# Altium project Dehumidity.PrjPcb
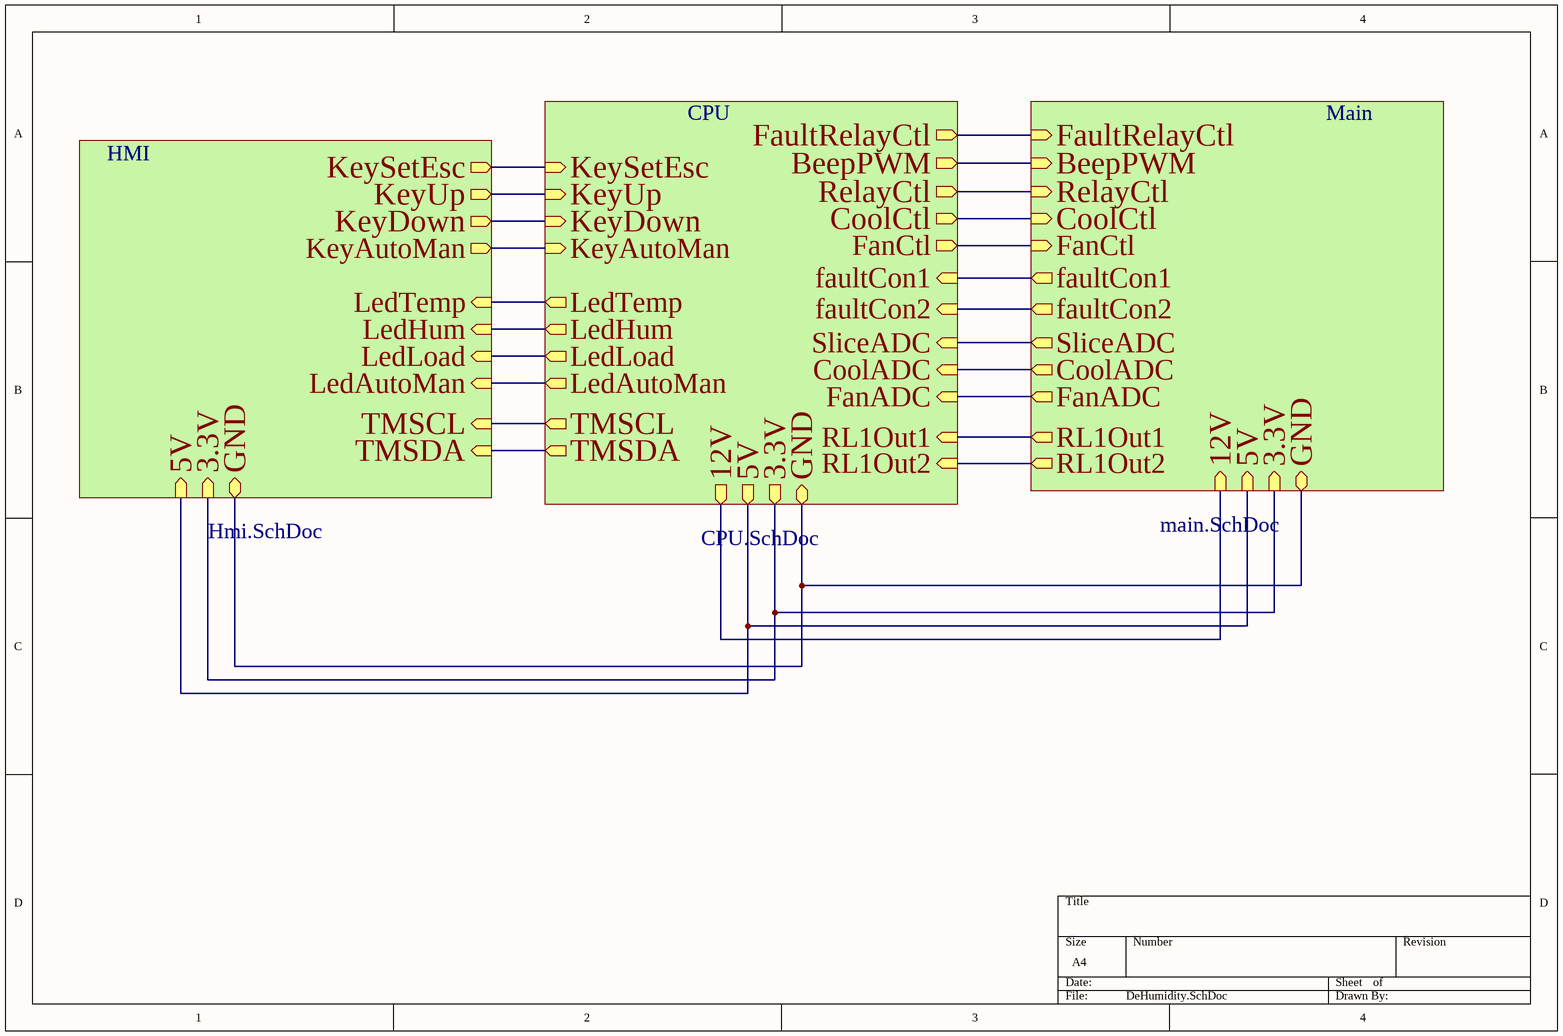
[diagram p0: DeHumidity.SchDoc]
4 sheets, 128 parts. Net scope: hierarchical (ports join the sheet entries above them; power ports are global).
Board file: PCB1_v01.PcbDoc
Sheets:
  DeHumidity.SchDoc
    HMI = Hmi.SchDoc
    Main = main.SchDoc
    CPU = CPU.SchDoc

## Sheet DeHumidity.SchDoc
size A4

### Sub-sheets
CPU = CPU.SchDoc: LedTemp (out), 3.3V (out), GND (bidir), 5V (out), LedHum (out), LedLoad (out), LedAutoMan (out), KeyAutoMan (in), KeyUp (in), KeyDown (in), KeySetEsc (in), RL1Out1 (in), RelayCtl (out), CoolCtl (out), BeepPWM (out), FanCtl (out), SliceADC (in), CoolADC (in), FanADC (in), 12V (out), TMSCL (out), TMSDA (out), RL1Out2 (in), faultCon1 (in), faultCon2 (in), FaultRelayCtl (out)
HMI = Hmi.SchDoc: LedTemp (in), KeyAutoMan (out), KeyUp (out), KeyDown (out), KeySetEsc (out), LedHum (in), LedLoad (in), LedAutoMan (in), TMSCL (in), TMSDA (in), 3.3V (in), GND (bidir), 5V (in)
Main = main.SchDoc: RL1Out1 (out), RelayCtl (in), CoolCtl (in), BeepPWM (in), SliceADC (out), CoolADC (out), FanADC (out), FanCtl (in), 3.3V (in), GND (bidir), 5V (in), 12V (in), RL1Out2 (out), faultCon1 (out), faultCon2 (out), FaultRelayCtl (in)

### Nets
3.3V: sheet HMI/3.3V, sheet Main/3.3V, sheet CPU/3.3V
5V: sheet HMI/5V, sheet Main/5V, sheet CPU/5V
12V: sheet Main/12V, sheet CPU/12V
GND: sheet HMI/GND, sheet Main/GND, sheet CPU/GND
NetC1_2: sheet HMI/KeySetEsc, sheet CPU/KeySetEsc
NetC2_2: sheet HMI/KeyUp, sheet CPU/KeyUp
NetC3_2: sheet HMI/KeyDown, sheet CPU/KeyDown
NetC4_2: sheet HMI/KeyAutoMan, sheet CPU/KeyAutoMan
NetC10_2: sheet Main/FanADC, sheet CPU/FanADC
NetC11_2: sheet Main/CoolADC, sheet CPU/CoolADC
NetC15_2: sheet Main/SliceADC, sheet CPU/SliceADC
NetD1_2: sheet HMI/LedTemp, sheet CPU/LedTemp
NetD2_2: sheet HMI/LedHum, sheet CPU/LedHum
NetD3_2: sheet HMI/LedLoad, sheet CPU/LedLoad
NetD4_2: sheet HMI/LedAutoMan, sheet CPU/LedAutoMan
NetP9_7: sheet Main/faultCon1, sheet CPU/faultCon1
NetP9_8: sheet Main/faultCon2, sheet CPU/faultCon2
NetP9_9: sheet Main/RL1Out2, sheet CPU/RL1Out2
NetP9_10: sheet Main/RL1Out1, sheet CPU/RL1Out1
NetR15_1: sheet HMI/TMSDA, sheet CPU/TMSDA
NetR16_1: sheet HMI/TMSCL, sheet CPU/TMSCL
NetR21_2: sheet Main/CoolCtl, sheet CPU/CoolCtl
NetR22_2: sheet Main/FanCtl, sheet CPU/FanCtl
NetR34_2: sheet Main/BeepPWM, sheet CPU/BeepPWM
NetR35_2: sheet Main/RelayCtl, sheet CPU/RelayCtl
NetR54_2: sheet Main/FaultRelayCtl, sheet CPU/FaultRelayCtl

## Sheet Hmi.SchDoc
size A4
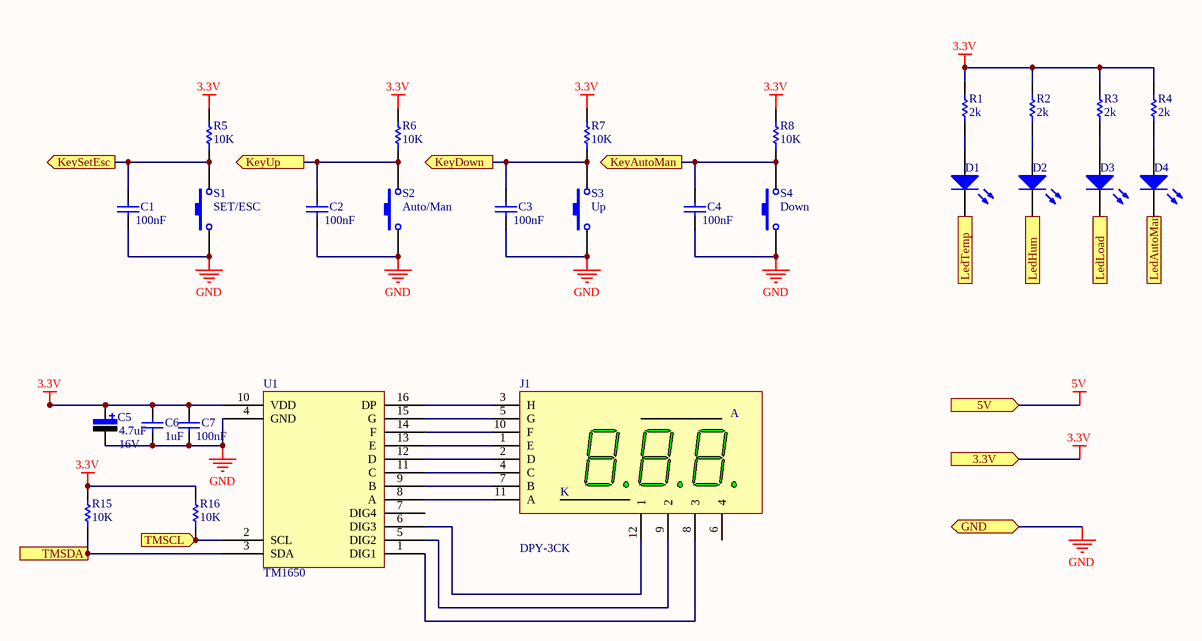
[diagram p1: Hmi.SchDoc]

### Parts
C1  100nF (104) 10% 50V  [0603_C]  (value not drawn)
C2  100nF (104) 10% 50V  [0603_C]  (value not drawn)
C3  100nF (104) 10% 50V  [0603_C]  (value not drawn)
C4  100nF (104) 10% 50V  [0603_C]  (value not drawn)
C5  value 4.7uF  Vol: 16V  [CAP-1206]  (hidden comment: 4.7uF/16V)
C6  1uF (105) 10% 50V  [0603_C]  (value not drawn)
C7  100nF (104) 10% 50V  [0603_C]  (value not drawn)
D1  LED  [LED(小)]  (value not drawn)
D2  LED  [LED(小)]  (value not drawn)
D3  LED  [LED(小)]  (value not drawn)
D4  LED  [LED(小)]  (value not drawn)
J1  DPY-3CK  [DYP-3BIT_2.8]
R1  2k  [0603_R]
R2  2k  [0603_R]
R3  2k  [0603_R]
R4  2k  [0603_R]
R5  10K  [0603_R]
R6  10K  [0603_R]
R7  10K  [0603_R]
R8  10K  [0603_R]
R15  10K  [0603_R]
R16  10K  [0603_R]
S1  SET/ESC  [Switch_4_6*6]
S2  Auto/Man  [Switch_4_6*6]
S3  Up  [Switch_4_6*6]
S4  Down  [Switch_4_6*6]
U1  TM1650  [SOIC-16_150mil]

### Ports
3.3V (in), 5V (in), GND (bidir), KeyAutoMan (out), KeyDown (out), KeySetEsc (out), KeyUp (out), LedAutoMan (in), LedHum (in), LedLoad (in), LedTemp (in), TMSCL (in), TMSDA (in)

### Nets
3.3V: C5.1 C6.2 C7.2 R1.1 R2.1 R3.1 R4.1 R5.2 R6.2 R7.2 R8.2 R15.2 R16.2 U1.10(VDD) ; port 3.3V
GND: C1.1 C2.1 C3.1 C4.1 C5.2 C6.1 C7.1 S1.1 S2.1 S3.1 S4.1 U1.4(GND) ; port GND
NetC1_2: C1.2 R5.1 S1.2 ; port KeySetEsc
NetC2_2: C2.2 R6.1 S2.2 ; port KeyUp
NetC3_2: C3.2 R7.1 S3.2 ; port KeyDown
NetC4_2: C4.2 R8.1 S4.2 ; port KeyAutoMan
NetD1_1: D1.1(A) R1.2
NetD1_2: D1.2(K) ; port LedTemp
NetD2_1: D2.1(A) R2.2
NetD2_2: D2.2(K) ; port LedHum
NetD3_1: D3.1(A) R3.2
NetD3_2: D3.2(K) ; port LedLoad
NetD4_1: D4.1(A) R4.2
NetD4_2: D4.2(K) ; port LedAutoMan
NetJ1_1: J1.1(E) U1.13(E)
NetJ1_2: J1.2(D) U1.12(D)
NetJ1_3: J1.3(H) U1.16(DP)
NetJ1_4: J1.4(C) U1.11(C)
NetJ1_5: J1.5(G) U1.15(G)
NetJ1_7: J1.7(B) U1.9(B)
NetJ1_8: J1.8(3) U1.1(DIG1)
NetJ1_9: J1.9(2) U1.5(DIG2)
NetJ1_10: J1.10(F) U1.14(F)
NetJ1_11: J1.11(A) U1.8(A)
NetJ1_12: J1.12(1) U1.6(DIG3)
NetR15_1: R15.1 U1.3(SDA) ; port TMSDA
NetR16_1: R16.1 U1.2(SCL) ; port TMSCL

Not connected (* = marked no-connect by the designer): J1 6(4); U1 7(DIG4)

### Notes on the sheet
- (in symbol 0603 1uF (105) 10% 50V) 1uF
- (in symbol 0603 100nF (104) 10% 50V) 100nF
- (in symbol DPY-3CK_1) K

### Library data of the parts
C1-C4 C7 = 0603 100nF (104) 10% 50V: 贴片电容; ComponentLink1Description: 供应商链接; ComponentLink1URL: http://www.szlcsc.com/product/details_15331.html; Package: 0603; Supplier: LC; SuppliersPartNumber: C14663
C5 = Cap Pol: 4.7uF/16V钽电容; Published: 8-Jun-2000; LatestRevisionDate: 17-Jul-2002; LatestRevisionNote: Re-released for DXP Platform.; PackageReference: RB7.6-15; Publisher: Altium Limited
C6 = 0603 1uF (105) 10% 50V: 贴片电容; ComponentLink1Description: 供应商链接; ComponentLink1URL: http://www.szlcsc.com/product/details_16531.html; Package: 0603; Supplier: LC; SuppliersPartNumber: C15849
D1-D4 = LED0: Typical INFRARED GaAs LED; Published: 8-Jun-2000; LatestRevisionDate: 08-Jul-2005; LatestRevisionNote: Mech Layer 1 removed.; PackageReference: LED-0; Publisher: Altium Limited
J1 = DPY-3CK_1: 共阴3位数码管
R1-R4 = RES1: 2k/±10%; 零件名称: 贴片电阻
R5-R8 R15 R16 = RES1: 10K/±10%; 零件名称: 贴片电阻
S1-S4 = SW-PB: 6*6*5四脚直插轻触开关; 零件名称: 直插开关

## Sheet main.SchDoc
size A4
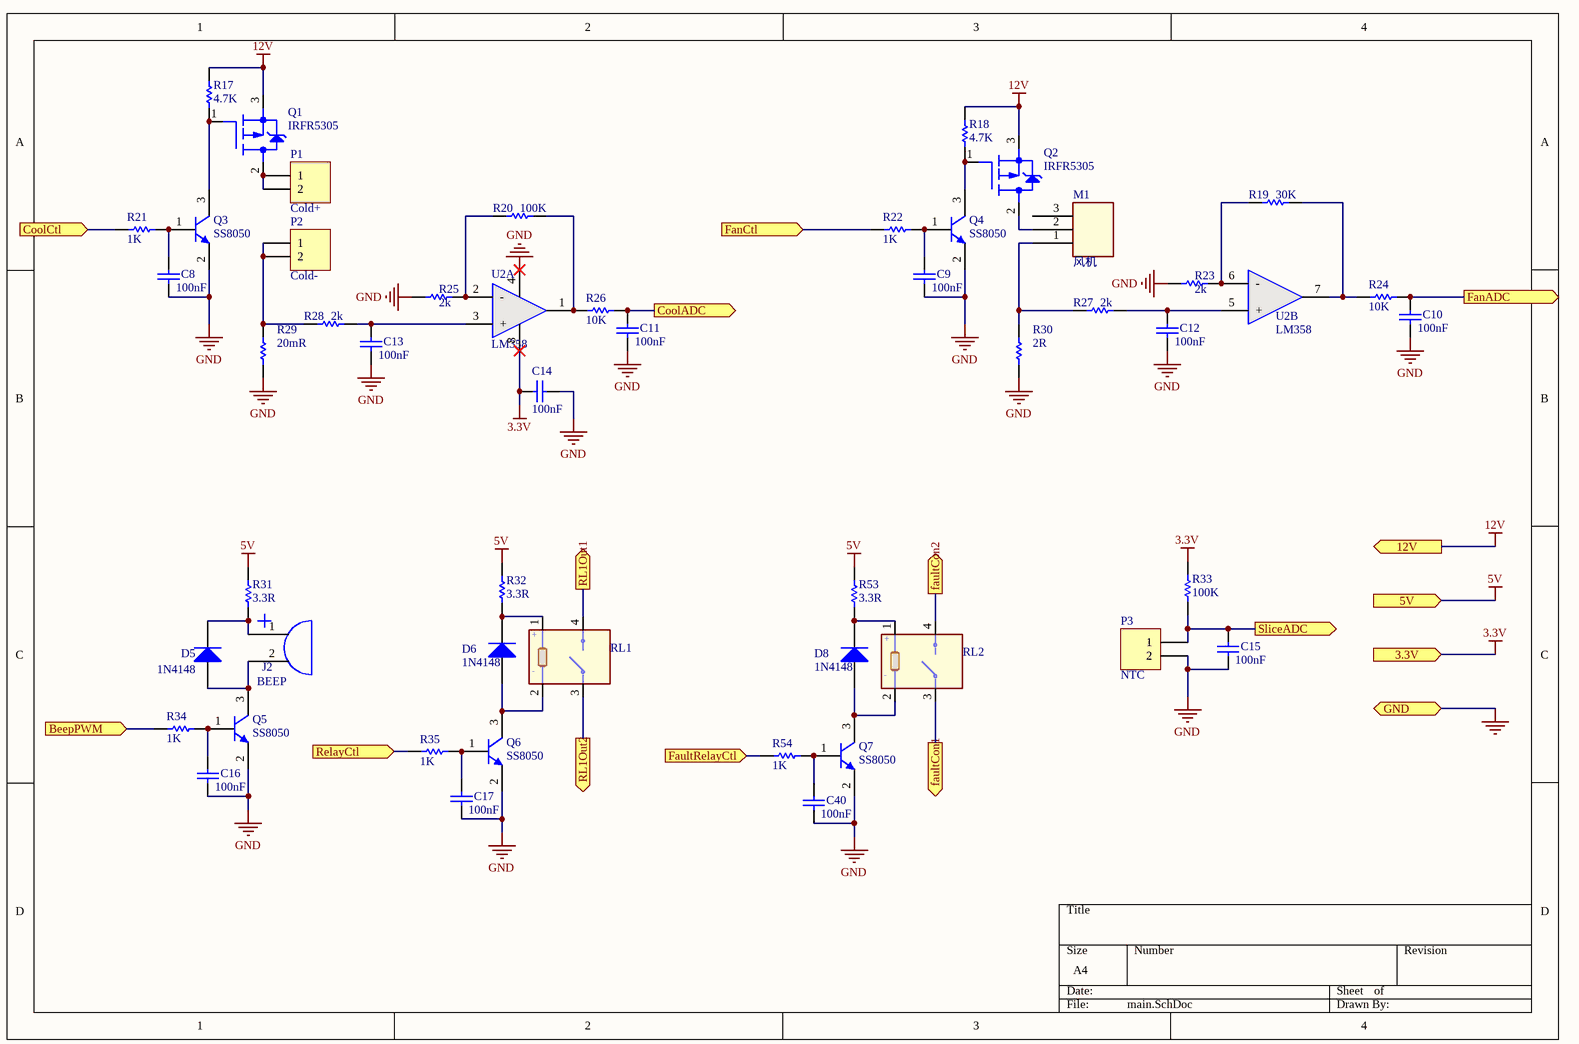
[diagram p2: main.SchDoc]

### Parts
C8  100nF (104) 10% 50V  [0603_C]  (value not drawn)
C9  100nF (104) 10% 50V  [0603_C]  (value not drawn)
C10  100nF (104) 10% 50V  [0603_C]  (value not drawn)
C11  100nF (104) 10% 50V  [0603_C]  (value not drawn)
C12  100nF (104) 10% 50V  [0603_C]  (value not drawn)
C13  100nF (104) 10% 50V  [0603_C]  (value not drawn)
C14  100nF (104) 10% 50V  [0603_C]  (value not drawn)
C15  100nF (104) 10% 50V  [0603_C]  (value not drawn)
C16  100nF (104) 10% 50V  [0603_C]  (value not drawn)
C17  100nF (104) 10% 50V  [0603_C]  (value not drawn)
C40  100nF (104) 10% 50V  [0603_C]  (value not drawn)
D5  1N4148  [DIODE-1206]
D6  1N4148  [DIODE-1206]
D8  1N4148  [DIODE-1206]
J2  BEEP  [Beep0905]
M1  风机  [connector3x2.5]
P1  Cold+  [ConSlice0.5]
P2  Cold-  [ConSlice0.5]
P3  NTC  [HDR1X2_2]
Q1  IRFR5305  [DPAK]
Q2  IRFR5305  [DPAK]
Q3  SS8050  [SOT-23]
Q4  SS8050  [SOT-23]
Q5  SS8050  [SOT-23]
Q6  SS8050  [SOT-23]
Q7  SS8050  [SOT-23]
R17  4.7K  [RESC1608N-R0603]
R18  4.7K  [RESC1608N-R0603]
R19  30K  [RESC1608N-R0603]
R20  100K  [RESC1608N-R0603]
R21  1K  [RESC1608N-R0603]
R22  1K  [RESC1608N-R0603]
R23  2k  [RESC1608N-R0603]
R24  10K  [RESC1608N-R0603]
R25  2k  [RESC1608N-R0603]
R26  10K  [RESC1608N-R0603]
R27  2k  [RESC1608N-R0603]
R28  2k  [RESC1608N-R0603]
R29  20mR  [Rsense10mm]
R30  2R  [R0.4x14.5]
R31  3.3R  [RESC1608N-R0603]
R32  3.3R  [RESC1608N-R0603]
R33  100K  [RESC1608N-R0603]
R34  1K  [RESC1608N-R0603]
R35  1K  [RESC1608N-R0603]
R53  3.3R  [RESC1608N-R0603]
R54  1K  [RESC1608N-R0603]
RL1  TXS2-24V  [ALDP112]  (value not drawn)
RL2  TXS2-24V  [ALDP112]  (value not drawn)
U2  LM358  [NSO8_N]  (parts A,B of 2)

### Ports
3.3V (in), 5V (in), 12V (out), BeepPWM (in), CoolADC (out), CoolCtl (in), FanADC (out), FanCtl (in), faultCon1 (out), faultCon2 (out), FaultRelayCtl (in), GND (bidir), RelayCtl (in), RL1Out1 (out), RL1Out2 (out), SliceADC (out)

### Nets
3.3V: C14.2 R33.1 U2.8(V+) ; port 3.3V
5V: R31.1 R32.1 R53.1 ; port 5V
12V: Q1.3(S) Q2.3(S) R17.1 R18.1 ; port 12V
GND: C8.1 C9.1 C10.1 C11.1 C12.1 C13.1 C14.1 C15.1 C16.1 C17.1 C40.1 P3.2 Q3.2(E) Q4.2(E) Q5.2(E) Q6.2(E) Q7.2(E) R23.2 R25.2 R29.1 R30.1 U2.4(V-) ; port GND
NetC8_2: C8.2 Q3.1(B) R21.1
NetC9_2: C9.2 Q4.1(B) R22.1
NetC10_2: C10.2 R24.1 ; port FanADC
NetC11_2: C11.2 R26.1 ; port CoolADC
NetC12_2: C12.2 R27.1 U2.5(+)
NetC13_2: C13.2 R28.1 U2.3(+)
NetC15_2: C15.2 P3.1 R33.2 ; port SliceADC
NetC16_2: C16.2 Q5.1(B) R34.1
NetC17_2: C17.2 Q6.1(B) R35.1
NetC40_2: C40.2 Q7.1(B) R54.1
NetD5_1: D5.1(A) J2.2 Q5.3(C)
NetD5_2: D5.2(K) J2.1 R31.2
NetD6_1: D6.1(A) Q6.3(C) RL1.2
NetD6_2: D6.2(K) R32.2 RL1.1
NetD8_1: D8.1(A) Q7.3(C) RL2.2
NetD8_2: D8.2(K) R53.2 RL2.1
NetM1_1: M1.1 R27.2 R30.2
NetM1_2: M1.2 Q2.2(D)
NetP1_1: P1.1 P1.2 Q1.2(D)
NetP2_1: P2.1 P2.2 R28.2 R29.2
NetP9_7: RL2.3 ; port faultCon1
NetP9_8: RL2.4 ; port faultCon2
NetP9_9: RL1.3 ; port RL1Out2
NetP9_10: RL1.4 ; port RL1Out1
NetQ1_1: Q1.1(G) Q3.3(C) R17.2
NetQ2_1: Q2.1(G) Q4.3(C) R18.2
NetR19_1: R19.1 R24.2 U2.7(OUT2)
NetR19_2: R19.2 R23.1 U2.6(-)
NetR20_1: R20.1 R26.2 U2.1(OUT1)
NetR20_2: R20.2 R25.1 U2.2(-)
NetR21_2: R21.2 ; port CoolCtl
NetR22_2: R22.2 ; port FanCtl
NetR34_2: R34.2 ; port BeepPWM
NetR35_2: R35.2 ; port RelayCtl
NetR54_2: R54.2 ; port FaultRelayCtl

Not connected (* = marked no-connect by the designer): M1 3

### Notes on the sheet
- (in symbol 0603 100nF (104) 10% 50V) 100nF
- (in symbol SACE_TXS2-24V_1) +

### Library data of the parts
C8-C17 C40 = 0603 100nF (104) 10% 50V: 贴片电容; ComponentLink1Description: 供应商链接; ComponentLink1URL: http://www.szlcsc.com/product/details_15331.html; Package: 0603; Supplier: LC; SuppliersPartNumber: C14663
D5 = Diode: 二极管; Published: 8-Jun-2000; LatestRevisionDate: 17-Jul-2002; LatestRevisionNote: Re-released for DXP Platform.; PackageDocument: Sep-1996; PackageReference: SMC; Publisher: Altium Limited; Code_JEDEC: DO-214-AB; Type: 1N4148
D6 D8 = Diode: 二极管; Type: M7; Published: 8-Jun-2000; LatestRevisionDate: 17-Jul-2002; LatestRevisionNote: Re-released for DXP Platform.; PackageDocument: Sep-1996; PackageReference: SMC; Publisher: Altium Limited; Code_JEDEC: DO-214-AB
J2 = BEEP: 蜂鸣器
M1 = SACE_CON_3: MALE CONN. 3 POLES P=7.62mm; Mfr_name1: WEIDMULLER; Mfr_Part_Number1: 1625260000; Part_type: MALE\THT; RU_code: RU6199001; Nr_pole: 3; Nr_row: 1; Prepared: BONOMI P.; Approved: LANZONI L.; Valore: 1625260000; Case_Size: -; Width: 8.5; Height: 12; Plating: -; Max_Operating_temp: -; Min_Operating_temp: -; Solderability_temp: -; Max_storage_temp: -; Min_storage_temp: -; Datasheet: K:\ORCAD CAPTURE CIS DATABASE\DATASHEET\CONNECTORS; Make_date: L6622; Last_rev_date: L6622; RoHs: True; Export_Control: N.A.
P1-P3 = Header 2: Header, 2-Pin; LatestRevisionDate: 17-Jul-2002; LatestRevisionNote: Re-released for DXP Platform.; Publisher: Altium Limited
Q1 Q2 = SACE_MOSFET_P: P-CH MOSFET LOGIC LEVEL 12A 60V SMD; Mfr_name1: ST; Mfr_Part_Number1: STD12NF06L; Part_Type: MOSFET\N-CHANNEL\SMD; RU_code: RU5189002; PackageID: D-PAK_AA_PITCH2.286MM_2PINS; Solderability_temp: 10s at 275°C; Max_operating_temp: +175°C; Min_operating_temp: -55°C; Prepared: BONOMI P.; Approved: MANZOLI R.; Notes: ST: / STD12NE06L-T4 is obsolete; Tolerance: -; Case_size: DPAK; Max_storage_temp: +175°C; Min_storage_temp: -55°C; Datasheet: K:\ORCAD CAPTURE CIS DATABASE\DATASHEET\DISCRETE; Make_date: L2587_DT; Last_rev_date: L3084_DT; RoHs: True; Export Control: N.A.; Valore: IRFR5305
Q3-Q7 = SS8050: NPN贴片三极管; Published: 8-Jun-2000; LatestRevisionDate: 15-Jan-2003; LatestRevisionNote: PCB Footprint 'BCY-W3/D4.7' replaced; DatasheetDocument: 1997; PackageDocument: Sep-1998; PackageReference: TO-92A; Publisher: Altium Limited; Code_JEDEC: TO-92A; ComponentLink1Description: Manufacturer Link; ComponentLink1URL: http://www.fairchildsemi.com/; ComponentLink2Description: Datasheet; ComponentLink2URL: http://www.fairchildsemi.com/ds/2N%2F2N3904.pdf
R17 R18 = RES1: 4.7K/±10%; 零件名称: 贴片电阻
R19 = RES1: 30K/±1%; 零件名称: 贴片电阻
R20 R33 = RES1: 100K/±10%; 零件名称: 贴片电阻
R21 R22 R34 R35 R54 = RES1: 1K/±10%; 零件名称: 贴片电阻
R23 R25 R27 R28 = RES1: 2k/±10%; 零件名称: 贴片电阻
R24 R26 = RES1: 10K/±10%; 零件名称: 贴片电阻
R29 R30 = Res1: Resistor; Value: 2mR; Published: 8-Jun-2000; LatestRevisionDate: 17-Jul-2002; LatestRevisionNote: Re-released for DXP Platform.; PackageReference: AXIAL-0.3; Publisher: Altium Limited; PackageDescription: Axial Device, Thru-Hole; 2 Leads; 0.3 in Pin Spacing
R31 R32 R53 = RES1: 3.3R/±10%; 零件名称: 贴片电阻
RL1 RL2 = SACE_TXS2-24V_1: MONOSTABLE RELAY 2POLES 110V 1A COIL24V; Mfr_name1: PANASONIC; Part_type: MONOSTABILE\THT; RU_code: RU6550001; Rated_voltage: 24; Max_operating_temp: +70°C; Min_operating_temp: -40°C; Life: 5x10^7 operations; Prepared: BONOMI P.; Approved: LANZONI L.; Valore: TXS2-24V; Mfr_Part_Number1: TXS2-24V; Case_Size: THT; Width: 7.4; Height: 8.2; Length: 15; Max_storage_temp: +70°C; Min_storage_temp: -40°C; Solderability_temp: -; Datasheet: K:\ORCAD CAPTURE CIS DATABASE\DATASHEET\RELAIS; Make_date: L9352; Last_rev_date: L9352; RoHs: True; Export_Control: N.A.
U2 = LM358: 双运放

## Sheet CPU.SchDoc
size A4
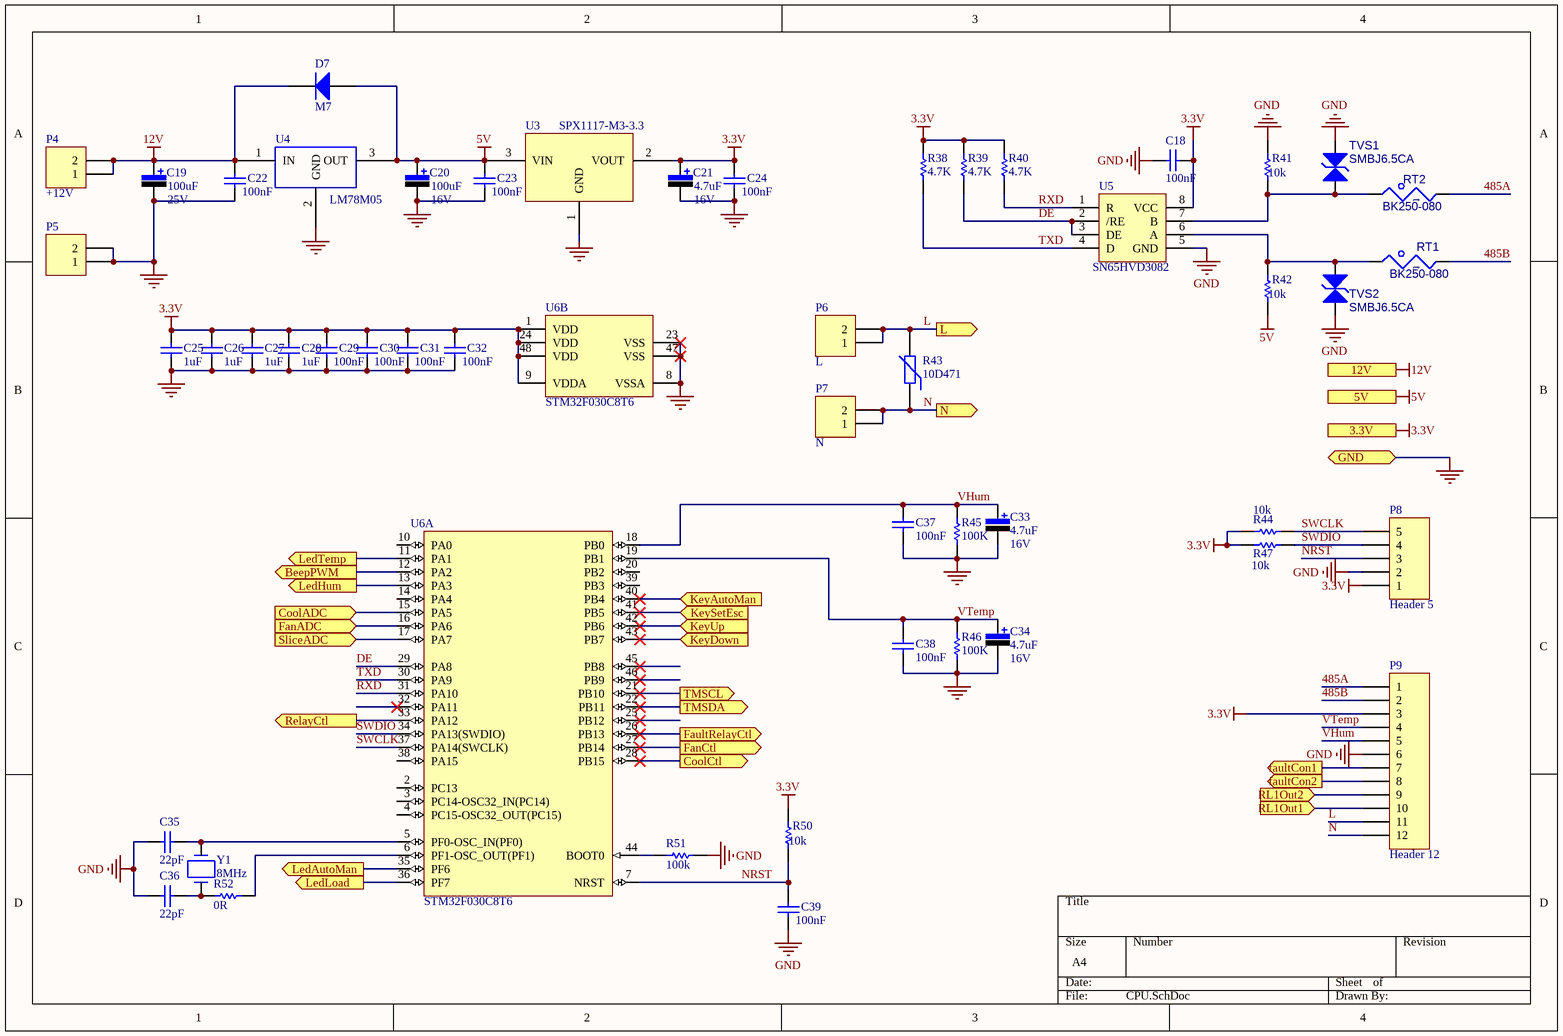
[diagram p3: CPU.SchDoc]

### Parts
C18  100nF (104) 10% 50V  [0603_C]  (value not drawn)
C19  value 100uF  Vol: 25V  [C-RB-8]  (hidden comment: 100uF/25V)
C20  value 100uF  Vol: 16V  [C-RB-8]  (hidden comment: 100uF/16V)
C21  value 4.7uF  Vol: 16V  [CAP-1206]  (hidden comment: 4.7uF/16V)
C22  100nF (104) 10% 50V  [0603_C]  (value not drawn)
C23  100nF (104) 10% 50V  [0603_C]  (value not drawn)
C24  100nF (104) 10% 50V  [0603_C]  (value not drawn)
C25  1uF (105) 10% 50V  [0603_C]  (value not drawn)
C26  1uF (105) 10% 50V  [0603_C]  (value not drawn)
C27  1uF (105) 10% 50V  [0603_C]  (value not drawn)
C28  1uF (105) 10% 50V  [0603_C]  (value not drawn)
C29  100nF (104) 10% 50V  [0603_C]  (value not drawn)
C30  100nF (104) 10% 50V  [0603_C]  (value not drawn)
C31  100nF (104) 10% 50V  [0603_C]  (value not drawn)
C32  100nF (104) 10% 50V  [0603_C]  (value not drawn)
C33  value 4.7uF  Vol: 16V  [CAP-1206]  (hidden comment: 4.7uF/16V)
C34  value 4.7uF  Vol: 16V  [CAP-1206]  (hidden comment: 4.7uF/16V)
C35  22pF (220) 5% 50V  [0603_C]  (value not drawn)
C36  22pF (220) 5% 50V  [0603_C]  (value not drawn)
C37  100nF (104) 10% 50V  [0603_C]  (value not drawn)
C38  100nF (104) 10% 50V  [0603_C]  (value not drawn)
C39  100nF (104) 10% 50V  [0603_C]  (value not drawn)
D7  M7  [DO214AC-SMA]
P4  +12V  [ConSlice0.5]
P5  (no value)  [ConSlice0.5]
P6  L  [ConSlice0.5]
P7  N  [ConSlice0.5]
P8  Header 5  [HDR1X5]
P9  Header 12  [HDR3.5-12P_1]
R38  4.7K  [RESC1608N-R0603]
R39  4.7K  [RESC1608N-R0603]
R40  4.7K  [RESC1608N-R0603]
R41  10k  [RESC1608N-R0603]
R42  10k  [RESC1608N-R0603]
R43  10D471  [10D471K]
R44  10k  [RESC1608N-R0603]
R45  100K  [RESC1608N-R0603]
R46  100K  [RESC1608N-R0603]
R47  10k  [RESC1608N-R0603]
R50  10k  [RESC1608N-R0603]
R51  100k  [RESC1608N-R0603]
R52  0R  [RESC1608N-R0603]
RT1  BK250-080  [RAD0.2]
RT2  BK250-080  [RAD0.2]
TVS1  SMBJ6.5CA  [1812]
TVS2  SMBJ6.5CA  [1812]
U3  SPX1117-M3-3.3  [SOT223]
U4  LM78M05  [DPAK]
U5  SN65HVD3082  [SO-8]
U6  STM32F030C8T6  [STM-LQFP48_N]  (parts A,B of 2)
Y1  8MHz  [HC49S_th]

### Ports
3.3V (out), 5V (out), 12V (out), BeepPWM (out), CoolADC (in), CoolCtl (out), FanADC (in), FanCtl (out), faultCon1 (out), faultCon2 (out), FaultRelayCtl (out), GND (bidir), KeyAutoMan (in), KeyDown (in), KeySetEsc (in), KeyUp (in), L (out), LedAutoMan (out), LedHum (out), LedLoad (out), LedTemp (out), N (out), RelayCtl (out), RL1Out1 (in), RL1Out2 (in), SliceADC (in), TMSCL (out), TMSDA (out)

### Nets
3.3V: C18.1 C21.1 C24.2 C25.2 C26.2 C27.2 C28.2 C29.2 C30.2 C31.2 C32.2 P8.1 P9.3 R38.1 R39.1 R40.1 R44.1 R47.1 R50.1 U3.2(VOUT) U5.8(VCC) U6.1(VDD) U6.9(VDDA) U6.24(VDD) U6.48(VDD) ; port 3.3V
5V: C20.1 C23.2 D7.1(A) R42.2 U3.3(VIN) U4.3(OUT) ; port 5V
12V: C19.1 C22.2 D7.2(K) P4.1 P4.2 U4.1(IN) ; port 12V
GND: C18.2 C19.2 C20.2 C21.2 C22.1 C23.1 C24.1 C25.1 C26.1 C27.1 C28.1 C29.1 C30.1 C31.1 C32.1 C33.2 C34.2 C35.2 C36.2 C37.1 C38.1 C39.1 P5.1 P5.2 P8.2 P9.6 R41.1 R45.2 R46.2 R51.2 TVS1.1(A) TVS2.2(K) U3.1(GND) U4.2(GND) U5.5(GND) U6.8(VSSA) U6.23(VSS) U6.47(VSS) ; port GND
485A: P9.1 RT2.1
485B: P9.2 RT1.1
DE: R39.2 U5.2(/RE) U5.3(DE) U6.29(PA8)
L: P6.1 P6.2 P9.11 R43.2 ; port L
N: P7.1 P7.2 P9.12 R43.1 ; port N
NRST: C39.2 P8.3 R50.2 U6.7(NRST)
RXD: R40.2 U5.1(R) U6.31(PA10)
SWCLK: P8.5 R44.2 U6.37(PA14(SWCLK))
SWDIO: P8.4 R47.2 U6.34(PA13(SWDIO))
TXD: R38.2 U5.4(D) U6.30(PA9)
VHum: C33.1 C37.2 P9.5 R45.1 U6.18(PB0)
VTemp: C34.1 C38.2 P9.4 R46.1 U6.19(PB1)
NetC1_2: U6.41(PB5) ; port KeySetEsc
NetC2_2: U6.42(PB6) ; port KeyUp
NetC3_2: U6.43(PB7) ; port KeyDown
NetC4_2: U6.40(PB4) ; port KeyAutoMan
NetC10_2: U6.16(PA6) ; port FanADC
NetC11_2: U6.15(PA5) ; port CoolADC
NetC15_2: U6.17(PA7) ; port SliceADC
NetC35_1: C35.1 U6.5(PF0-OSC_IN(PF0)) Y1.1
NetC36_1: C36.1 R52.2 Y1.2
NetD1_2: U6.11(PA1) ; port LedTemp
NetD2_2: U6.13(PA3) ; port LedHum
NetD3_2: U6.36(PF7) ; port LedLoad
NetD4_2: U6.35(PF6) ; port LedAutoMan
NetP9_7: P9.7 ; port faultCon1
NetP9_8: P9.8 ; port faultCon2
NetP9_9: P9.9 ; port RL1Out2
NetP9_10: P9.10 ; port RL1Out1
NetR15_1: U6.22(PB11) ; port TMSDA
NetR16_1: U6.21(PB10) ; port TMSCL
NetR21_2: U6.28(PB15) ; port CoolCtl
NetR22_2: U6.27(PB14) ; port FanCtl
NetR34_2: U6.12(PA2) ; port BeepPWM
NetR35_2: U6.33(PA12) ; port RelayCtl
NetR41_2: R41.2 RT2.2 TVS1.2(K) U5.7(B)
NetR42_1: R42.1 RT1.2 TVS2.1(A) U5.6(A)
NetR51_1: R51.1 U6.44(BOOT0)
NetR52_1: R52.1 U6.6(PF1-OSC_OUT(PF1))
NetR54_2: U6.26(PB13) ; port FaultRelayCtl

Not connected (* = marked no-connect by the designer): U6 2(PC13) 3(PC14-OSC32_IN(PC14)) 4(PC15-OSC32_OUT(PC15)) 10(PA0) 14(PA4) 20(PB2) 25(PB12)* 32(PA11)* 38(PA15) 39(PB3) 45(PB8)* 46(PB9)*

### Notes on the sheet
- (in symbol 0603 1uF (105) 10% 50V) 1uF
- (in symbol 0603 22pF (220) 5% 50V) 22pF
- (in symbol 0603 100nF (104) 10% 50V) 100nF
- (in symbol PTC-Thermistor) t

### Library data of the parts
C18 C22-C24 C29-C32 C37-C39 = 0603 100nF (104) 10% 50V: 贴片电容; ComponentLink1Description: 供应商链接; ComponentLink1URL: http://www.szlcsc.com/product/details_15331.html; Package: 0603; Supplier: LC; SuppliersPartNumber: C14663
C19 C20 = Cap Pol: Published: 8-Jun-2000; LatestRevisionDate: 17-Jul-2002; LatestRevisionNote: Re-released for DXP Platform.; PackageReference: RB7.6-15; Publisher: Altium Limited
C21 C33 C34 = Cap Pol: 4.7uF/16V钽电容; Published: 8-Jun-2000; LatestRevisionDate: 17-Jul-2002; LatestRevisionNote: Re-released for DXP Platform.; PackageReference: RB7.6-15; Publisher: Altium Limited
C25-C28 = 0603 1uF (105) 10% 50V: 贴片电容; ComponentLink1Description: 供应商链接; ComponentLink1URL: http://www.szlcsc.com/product/details_16531.html; Package: 0603; Supplier: LC; SuppliersPartNumber: C15849
C35 C36 = 0603 22pF (220) 5% 50V: 贴片电容; ComponentLink1Description: 供应商链接; ComponentLink1URL: http://www.szlcsc.com/product/details_2005.html; Package: 0603; Supplier: LC; SuppliersPartNumber: C1653
D7 = Diode: 二极管; Published: 8-Jun-2000; LatestRevisionDate: 17-Jul-2002; LatestRevisionNote: Re-released for DXP Platform.; PackageDocument: Sep-1996; PackageReference: SMC; Publisher: Altium Limited; Code_JEDEC: DO-214-AB; Type: M7
P4-P7 = Header 2: Header, 2-Pin; LatestRevisionDate: 17-Jul-2002; LatestRevisionNote: Re-released for DXP Platform.; Publisher: Altium Limited
P8 = Header 5: Header, 5-Pin; LatestRevisionDate: 17-Jul-2002; LatestRevisionNote: Re-released for DXP Platform.; Publisher: Altium Limited
P9 = Header 12: Header, 12-Pin; LatestRevisionDate: 17-Jul-2002; LatestRevisionNote: Re-released for DXP Platform.; Publisher: Altium Limited
R38-R40 = RES1: 4.7K/±10%; 零件名称: 贴片电阻
R41 R42 R44 R47 R50 = RES1: 10k/±10%; 零件名称: 贴片电阻
R43 = Res Varistor: Varistor (Voltage-Sensitive Resistor); Published: 24-Mar-1999; LatestRevisionDate: 29-May-2009; LatestRevisionNote: IPC-7351 Footprint Added.; PackageVersion: Mar-2003; PackageReference: 6-0805; Publisher: Altium Limited; PackageDescription: Chip Resistor 0805 Case Size; Code_IPC: RESC2012
R45 R46 R51 = RES1: 100K/±10%; 零件名称: 贴片电阻
R52 = RES1: 0R±10%; 零件名称: 贴片电阻
RT1 RT2 = PTC-Thermistor: 热敏电阻
TVS1 TVS2 = TVS管-贴片: TVS
U3 = IC-SPX1117M3-L-3.3 工业级 SOT-223 SIPEX: U_TABLE: U_IC; LH: I03-011173-601; U_ITEM_ID（U_ITEM_ID）: Part00003063; U_OBJECT_NAME（U_OBJECT_NAME）: 芯片; U_1002（U_1002）: SIPEX; U_200003（U_200003）: 工业级; U_CL2_ITEMM_00（U_CL2_ITEMM_00）: I03-011173-601; U_CL2_ITEMR_00（U_CL2_ITEMR_00）: SPX1117M3-L-3.3 工业级 SOT-223 SIPEX; U_200002（U_200002）: SPX1117M3-L-3.3; U_200004（U_200004）: SOT-223
U4 = LDO-78XX_1: PART CODE: ?
U5 = RS485
U6 = STM32F030C8T6: Core: ARM Cortex-M0; FLASH Size (Prog) (kB): 64; I/Os (High Current): 39; Internal RAM Size (kB): 8; Operating Frequency(F) (Processor speed) (MHz): 48; Packing: Tray; Supply Voltage(Vcc) min (V): 2.4; DatasheetVersion: Rev. 1; PackageVersion: Rev. 6, 06/2013; PackageReference: LQFP48; PackageDescription: 48-Pin Low Profile Quad Flat Package, 7 x 7 mm Body, 0.5 mm Pitch; Supplier 1: Digi-Key; Supplier Part Number 1: 497-14043-ND; Supplier 2: Newark; Supplier Part Number 2: 06X3647; Supplier 3: Mouser; Supplier Part Number 3: 511-STM32F030C8T6; Mounting Technology: Surface Mount; PartNumber: STM32F030C8T6; ComponentLink1Description: Manufacturer URL; ComponentLink1URL: http://www.st.com/web/en/home.html; ComponentLink2Description: Datasheet; ComponentLink2URL: http://www.st.com/st-web-ui/static/active/en/resource/technical/document/datasheet/DM00088500.pdf; ComponentLink3Description: Package Specification; ComponentLink3URL: http://www.st.com/st-web-ui/static/active/en/resource/technical/document/datasheet/DM00058181.pdf
Y1 = RU5608001: QUARTZ 8MHz SMD; Mfr_name1: 2B-ELETTRONICA; Mfr_Part_Number1: TP0871/F; Part_type: QUARTZ\SMD; Prepared: BONOMI P.; Approved: MANZOLI R.; RU_code: RU5608001; PackageID: RU5608001; Valore: 8MHz; Case_size: SMD; Datasheet: K:\ORCAD CAPTURE CIS DATABASE\DATASHEET\QUARTZ_RESONATOR; Make_date: L2587_DT; Last_rev_date: L3084_DT; RoHs: True; Export_Control: N.A.

## Nets that join several sheets
3.3V: Hmi (14 pins), main (C14.2 R33.1 U2.8), CPU (25 pins)
5V: main (R31.1 R32.1 R53.1), CPU (6 pins)
12V: main (Q1.3 Q2.3 R17.1 R18.1), CPU (6 pins)
GND: Hmi (12 pins), main (22 pins), CPU (38 pins)
NetC1_2: Hmi (C1.2 R5.1 S1.2), CPU (U6.41)
NetC2_2: Hmi (C2.2 R6.1 S2.2), CPU (U6.42)
NetC3_2: Hmi (C3.2 R7.1 S3.2), CPU (U6.43)
NetC4_2: Hmi (C4.2 R8.1 S4.2), CPU (U6.40)
NetC10_2: main (C10.2 R24.1), CPU (U6.16)
NetC11_2: main (C11.2 R26.1), CPU (U6.15)
NetC15_2: main (C15.2 P3.1 R33.2), CPU (U6.17)
NetD1_2: Hmi (D1.2), CPU (U6.11)
NetD2_2: Hmi (D2.2), CPU (U6.13)
NetD3_2: Hmi (D3.2), CPU (U6.36)
NetD4_2: Hmi (D4.2), CPU (U6.35)
NetP9_7: main (RL2.3), CPU (P9.7)
NetP9_8: main (RL2.4), CPU (P9.8)
NetP9_9: main (RL1.3), CPU (P9.9)
NetP9_10: main (RL1.4), CPU (P9.10)
NetR15_1: Hmi (R15.1 U1.3), CPU (U6.22)
NetR16_1: Hmi (R16.1 U1.2), CPU (U6.21)
NetR21_2: main (R21.2), CPU (U6.28)
NetR22_2: main (R22.2), CPU (U6.27)
NetR34_2: main (R34.2), CPU (U6.12)
NetR35_2: main (R35.2), CPU (U6.33)
NetR54_2: main (R54.2), CPU (U6.26)